# Altium project AD5686R.PrjPcb
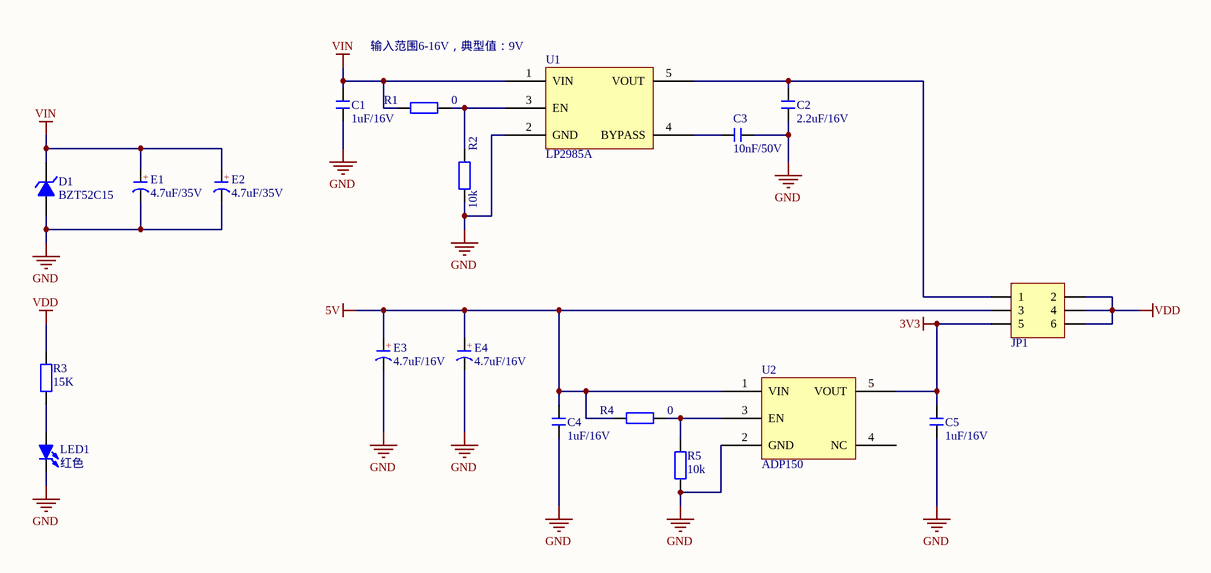
[diagram p0: POW.SchDoc]
2 sheets, 58 parts. Net scope: global (net labels, ports and power ports of the same name join across sheets).
Board file: PCB2.PcbDoc
Sheets:
  POW.SchDoc
  AD5686R.SchDoc

## Sheet POW.SchDoc
size A4; SheetNumber: 1; SheetTotal: 2

### Parts
C1  1uF/16V  [C 0402_L]
C2  2.2uF/16V  [C 0402_L]
C3  10nF/50V  [C 0402_L]
C4  1uF/16V  [C 0402_L]
C5  1uF/16V  [C 0402_L]
D1  BZT52C15  [SOD-123]
E1  4.7uF/35V  [CD E(7343H)]
E2  4.7uF/35V  [CD E(7343H)]
E3  4.7uF/16V  [CD A(3216)]
E4  4.7uF/16V  [CD A(3216)]
JP1  Header3X2  [HDR2.54-LI-2x3P]  (value not drawn)
LED1  红色  [LED]
R1  0  [R 0402_L]
R2  10k  [R 0402_L]
R3  15K  [R 0402_L]
R4  0  [R 0402_L]
R5  10k  [R 0402_L]
U1  LP2985A  [SOT23-5]
U2  ADP150  [SOT23-5]

### Nets
3V3: C5.2 JP1.5 U2.5(VOUT)
5V: C4.2 E3.1(A) E4.1(A) JP1.3 R4.2 U2.1(VIN)
GND: C1.1 C2.1 C3.2 C4.1 C5.1 D1.1(A) E1.2(K) E2.2(K) E3.2(K) E4.2(K) LED1.2(K) R2.2 R5.2 U1.2(GND) U2.2(GND)
VDD: JP1.2 JP1.4 JP1.6 R3.1
VIN: C1.2 D1.2(K) E1.1(A) E2.1(A) R1.2 U1.1(VIN)
NetC2_2: C2.2 JP1.1 U1.5(VOUT)
NetC3_1: C3.1 U1.4(BYPASS)
NetLED1_1: LED1.1(A) R3.2
NetR1_1: R1.1 R2.1 U1.3(EN)
NetR4_1: R4.1 R5.1 U2.3(EN)

Not connected (* = marked no-connect by the designer): U2 4(NC)

### Notes on the sheet
- 输入范围6-16V，典型值：9V
- (in symbol C-CD) +

### Library data of the parts
C1 C4 C5 = C: 贴片电容; 主类型: 电容; 值精度: ±10%; 元件封装: 0402; 具体类型: 陶瓷电容; 封装类型: 贴片; 温度漂移: X5R; 生产商: SAMSUNG(三星); 生产商零件编码: CL05A105KO5NNNC; 值/型号: 1uF/16V; 立创编号: C29266
C2 = C: 贴片电容; 主类型: 电容; 值精度: ±10%; 元件封装: 0402; 具体类型: 陶瓷电容; 封装类型: 贴片; 温度漂移: X5R; 生产商: SAMSUNG(三星); 生产商零件编码: CL05A225KO5NQNC; 值/型号: 2.2uF/16V; 立创编号: C170151
C3 = C: 贴片电容 10nF/50V; 主类型: 电容; 值精度: ±5%; 元件封装: 0402; 具体类型: 陶瓷电容; 封装类型: 贴片; 温度漂移: C0G; 温度范围: -55°C ~ 125°C; 生产商: YAGEO(国巨); 生产商零件编码: CC0402JRX7R9BB103; 值/型号: 10nF/50V; 立创编号: C272878
D1 = IN4735A: 主类型: 二极管; 具体类型: 稳压二极管; 封装类型: 贴片; 生产商: MDD; 值/型号: BZT52C15; 元件封装: SOD-123; 生产商零件编码: BZT52C15; 立创编号: C173427
E1 E2 = C-CD: 聚合物电容 4.7uF/35V; 主类型: 电容; 值精度: ±20%; 元件封装: CASE-D_7343; 封装类型: 贴片; 温度范围: -55℃ ~ +105℃; 生产商: VISHAY(威世); 生产商零件编码: 293D475X0035D2TE3; 值/型号: 4.7uF/35V; 具体类型: 聚合物电容; 立创编号: C215880
E3 E4 = C-CD: 聚合物电容 4.7uF/16V; 主类型: 电容; 值精度: ±20%; 元件封装: CASE-A_3216; 封装类型: 贴片; 温度范围: -55℃ ~ +105℃; 生产商: Sunlord(顺络); 生产商零件编码: TC211A475M016A; 值/型号: 4.7uF/16V; 具体类型: 聚合物电容; 立创编号: C136628
JP1 = Header 3X2: 3*2P接插件; 版权归属: 源创客; BOM名称: 3*2P接插件; 学习资源: www.ooocke.com
LED1 = LED-SMD: C84267
R1 R4 = R: 贴片电阻 0402 1%; 主类型: 电阻; 元件封装: 0402; 封装类型: 贴片; 温度漂移: ±100ppm/℃; 生产商: 国巨; 生产商零件编码: RC0402FR-070RL; 值/型号: 0; 值精度: ±1%; 具体类型: 贴片电阻; 立创编号: C106231
R2 R5 = R: 贴片电阻; 主类型: 电阻; 值精度: ±1%; 元件封装: 0402; 封装类型: 贴片; 温度漂移: ±100ppm/℃; 生产商: YAGEO（国巨）; 生产商零件编码: RC0402FR-0710KL; 值/型号: 10K; 具体类型: 贴片电阻; 立创编号: C60490
R3 = R: 贴片电阻 0402 5%; 主类型: 电阻; 值精度: ±1%; 元件封装: 0402; 封装类型: 贴片; 温度漂移: 50ppm; 生产商: 国巨; 生产商零件编码: RT0402FRE0715KL; 值/型号: 15K; 具体类型: 贴片电阻; 立创编号: C136975
U2 = ADP150: ADP150AUJZ-3.3-R7; 主类型: 电源芯片; 元件封装: SOT-23-5; 具体类型: 线性稳压芯片; 封装类型: 贴片; 生产商: ADI(亚德诺)/LINEAR; 值/型号: ADP150AUJZ-3.3-R7; 生产商零件编码: ADP150AUJZ-3.3-R7; 立创编号: C29149

## Sheet AD5686R.SchDoc
size A4; SheetNumber: 2; SheetTotal: 2
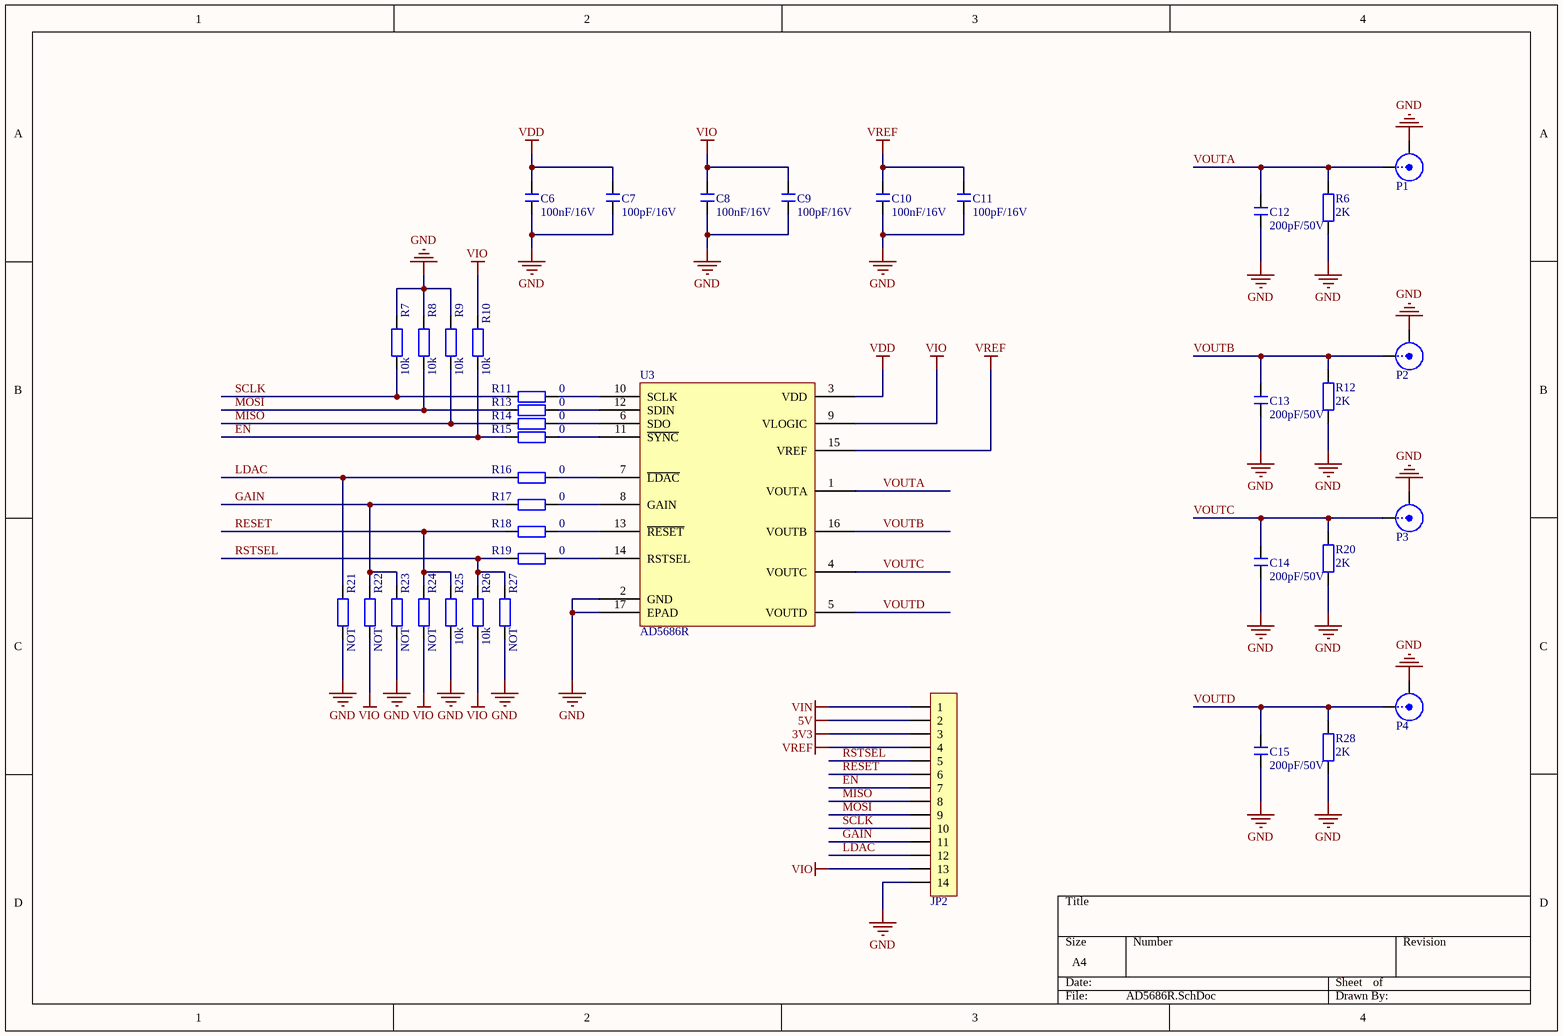
[diagram p1: AD5686R.SchDoc]

### Parts
C6  100nF/16V  [C 0402_L]
C7  100pF/16V  [C 0402_L]
C8  100nF/16V  [C 0402_L]
C9  100pF/16V  [C 0402_L]
C10  100nF/16V  [C 0402_L]
C11  100pF/16V  [C 0402_L]
C12  200pF/50V  [C 0402_L]
C13  200pF/50V  [C 0402_L]
C14  200pF/50V  [C 0402_L]
C15  200pF/50V  [C 0402_L]
JP2  HDR-1X14  [HDR2.54-LI-14P]  (value not drawn)
P1  SMB  [SMA]  (value not drawn)
P2  SMB  [SMA]  (value not drawn)
P3  SMB  [SMA]  (value not drawn)
P4  SMB  [SMA]  (value not drawn)
R6  2K  [R 0402_L]
R7  10k  [R 0402_L]
R8  10k  [R 0402_L]
R9  10k  [R 0402_L]
R10  10k  [R 0402_L]
R11  0  [R 0402_L]
R12  2K  [R 0402_L]
R13  0  [R 0402_L]
R14  0  [R 0402_L]
R15  0  [R 0402_L]
R16  0  [R 0402_L]
R17  0  [R 0402_L]
R18  0  [R 0402_L]
R19  0  [R 0402_L]
R20  2K  [R 0402_L]
R21  NOT  [R 0402_L]
R22  NOT  [R 0402_L]
R23  NOT  [R 0402_L]
R24  NOT  [R 0402_L]
R25  10k  [R 0402_L]
R26  10k  [R 0402_L]
R27  NOT  [R 0402_L]
R28  2K  [R 0402_L]
U3  AD5686R  [AD5686R]

### Nets
3V3: JP2.3
5V: JP2.2
GND: C6.1 C7.1 C8.1 C9.1 C10.1 C11.1 C12.1 C13.1 C14.1 C15.1 JP2.14 P1.2(Y) P2.2(Y) P3.2(Y) P4.2(Y) R6.2 R7.1 R8.1 R9.1 R12.2 R20.2 R21.1 R23.1 R25.2 R27.1 R28.2 U3.2(GND) U3.17(EPAD)
VDD: C6.2 C7.2 U3.3(VDD)
VIN: JP2.1
VIO: C8.2 C9.2 JP2.13 R10.1 R22.1 R24.1 R26.2 U3.9(VLOGIC)
VREF: C10.2 C11.2 JP2.4 U3.15(VREF)
EN: JP2.7 R10.2 R15.2
GAIN: JP2.11 R17.2 R22.2 R23.2
LDAC: JP2.12 R16.2 R21.2
MISO: JP2.8 R9.2 R14.2
MOSI: JP2.9 R8.2 R13.2
RESET: JP2.6 R18.2 R24.2 R25.1
RSTSEL: JP2.5 R19.2 R26.1 R27.2
SCLK: JP2.10 R7.2 R11.2
VOUTA: C12.2 P1.1(X) R6.1 U3.1(VOUTA)
VOUTB: C13.2 P2.1(X) R12.1 U3.16(VOUTB)
VOUTC: C14.2 P3.1(X) R20.1 U3.4(VOUTC)
VOUTD: C15.2 P4.1(X) R28.1 U3.5(VOUTD)
NetR11_1: R11.1 U3.10(SCLK)
NetR13_1: R13.1 U3.12(SDIN)
NetR14_1: R14.1 U3.6(SDO)
NetR15_1: R15.1 U3.11(~{SYNC})
NetR16_1: R16.1 U3.7(~{LDAC})
NetR17_1: R17.1 U3.8(GAIN)
NetR18_1: R18.1 U3.13(~{RESET})
NetR19_1: R19.1 U3.14(RSTSEL)

### Library data of the parts
C6 C8 C10 = C: 贴片电容; 主类型: 电容; 值精度: ±10%; 元件封装: 0402; 具体类型: 陶瓷电容; 封装类型: 贴片; 温度漂移: X7R（15%）; 温度范围: -55°C ~ 125°C; 生产商: YAGEO(国巨); 生产商零件编码: CC0402KRX7R7BB104; 值/型号: 100nF/16V; 立创编号: C60474
C7 C9 C11 = C: 贴片电容; 主类型: 电容; 值精度: ±10%; 元件封装: 0402; 具体类型: 陶瓷电容; 封装类型: 贴片; 温度漂移: X7R（15%）; 温度范围: -55°C ~ 125°C; 生产商: YAGEO(国巨); 生产商零件编码: CC0402JRNPO9BN101; 值/型号: 100pF/16V; 立创编号: C106200
C12-C15 = C: 贴片电容; 主类型: 电容; 值精度: ±5%; 元件封装: 0402; 具体类型: 陶瓷电容; 封装类型: 贴片; 温度漂移: X7R（15%）; 温度范围: -55°C ~ 125°C; 生产商: YAGEO(国巨); 生产商零件编码: CC0402JRNPO9BN201; 值/型号: 200pF/50V; 立创编号: C325462
JP2 = Header 14: 14P接插件; 版权归属: 源创客; BOM名称: 14P接插件; 学习资源: www.ooocke.com
P1-P4 = SMB: SMB Straight Connector
R6 R12 R20 R28 = R: 贴片电阻 0402 1%; 主类型: 电阻; 值精度: ±0.1%; 元件封装: 0402; 封装类型: 贴片; 温度漂移: ±100ppm/℃; 生产商: 光颉(Viking); 生产商零件编码: AR02BTC2001; 值/型号: 2K; 具体类型: 贴片电阻; 立创编号: C317918
R7-R10 R25 R26 = R: as R2 on sheet POW; 值/型号: 10K; 具体类型: 贴片电阻; 立创编号: C60490
R11 R13-R19 = R: as R1 on sheet POW; 值/型号: 0; 值精度: ±1%; 具体类型: 贴片电阻; 立创编号: C106231
R21-R24 R27 = R: 贴片电阻; 主类型: 电阻; 值/型号: 0; 值精度: ±1%; 元件封装: 0402; 封装类型: 贴片; 温度漂移: ±100ppm/℃; 生产商: YAGEO（国巨）; 生产商零件编码: RC0402FR-0710KL; 具体类型: 贴片电阻; 立创编号: C60490

## Nets that join several sheets
3V3: POW (C5.2 JP1.5 U2.5), AD5686R (JP2.3)
5V: POW (6 pins), AD5686R (JP2.2)
GND: POW (15 pins), AD5686R (28 pins)
VDD: POW (JP1.2 JP1.4 JP1.6 R3.1), AD5686R (C6.2 C7.2 U3.3)
VIN: POW (6 pins), AD5686R (JP2.1)